# Altium schematic sheet power.SchDoc: Power supply
size A4; Organization: GPA & FRYK Industries; DocumentNumber: 6; Revision: REV 0; SheetNumber: 6; SheetTotal: 6
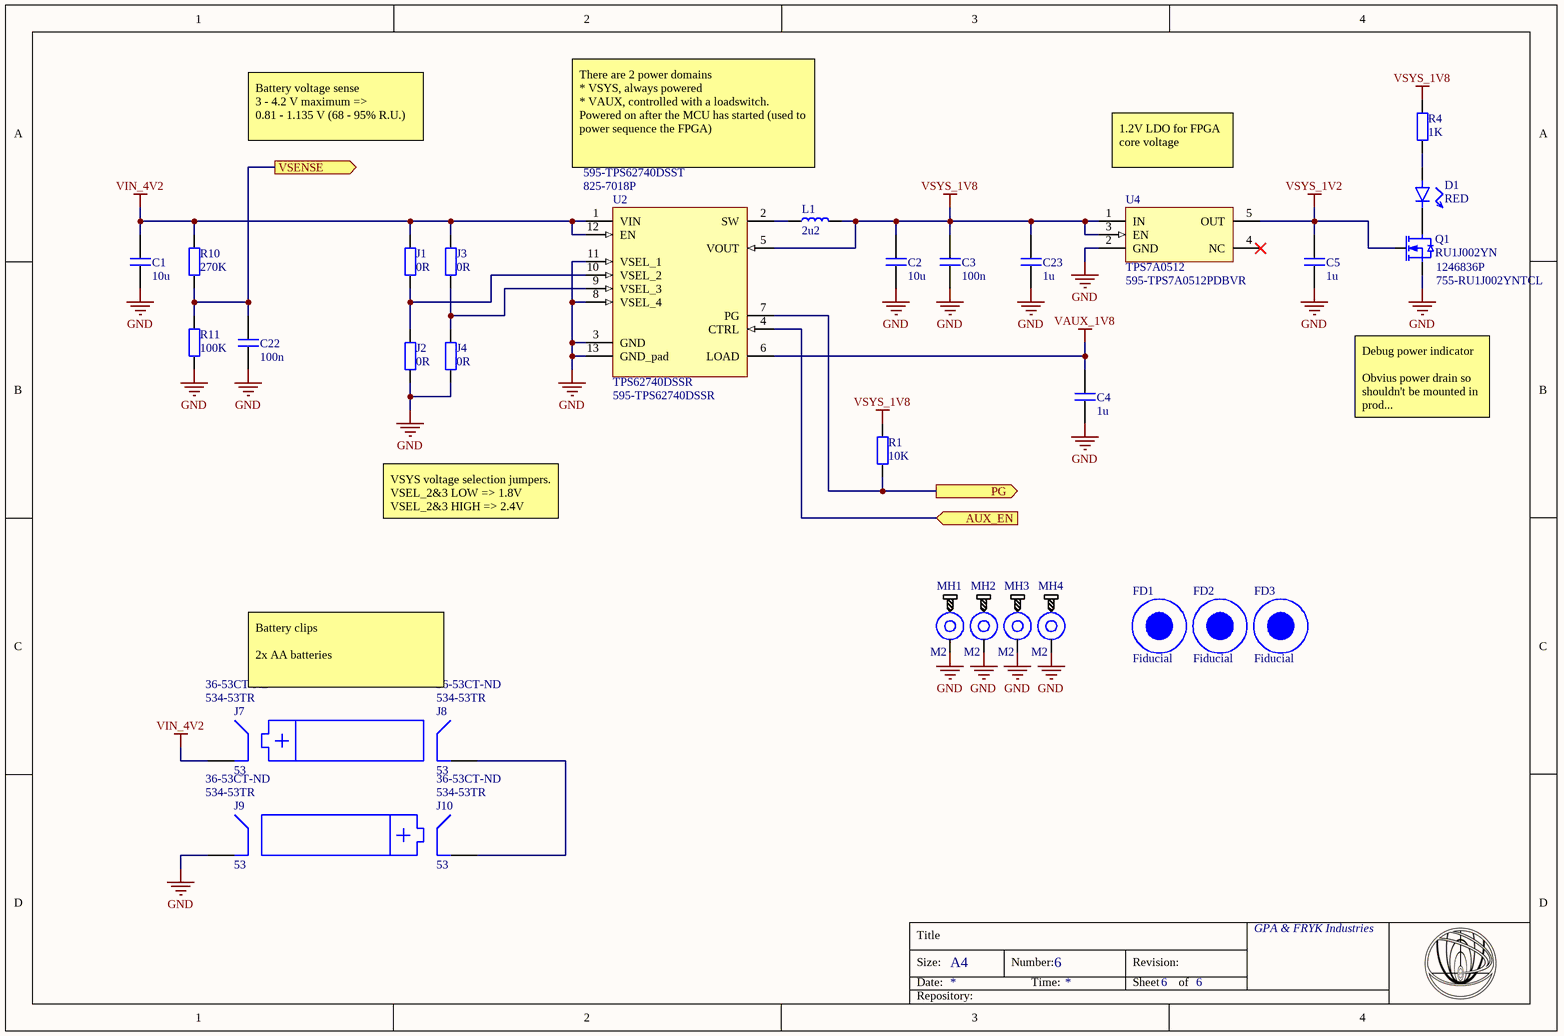
[diagram p0: power.SchDoc]

## Parts
C1  value 10u  [CAPC3216X14N]  (hidden comment: cap)
C2  value 10u  [CAPC3216X14N]  (hidden comment: cap)
C3  value 100n  [CAPC1005X06N]  (hidden comment: cap)
C4  value 1u  [CAPC2012X11N]  (hidden comment: cap)
C5  value 1u  [CAPC2012X11N]  (hidden comment: cap)
C22  value 100n  [CAPC1005X06N]  (hidden comment: cap)
C23  value 1u  [CAPC2012X11N]  (hidden comment: cap)
D1  value RED  [CAPCP1005X06N]  (hidden comment: led)
FD1  Fiducial  [fiducial_1_3]  (no BOM)
FD2  Fiducial  [fiducial_1_3]  (no BOM)
FD3  Fiducial  [fiducial_1_3]  (no BOM)
J1  value 0R  [RESC1005X04N]  (hidden comment: res)
J2  value 0R  [RESC1005X04N]  (hidden comment: res)
J3  value 0R  [RESC1005X04N]  (hidden comment: res)
J4  value 0R  [RESC1005X04N]  (hidden comment: res)
J7  53  Supplier Part Number 1: 534-53TR  Supplier Part Number 2: 36-53CT-ND  [ke53]
J8  53  Supplier Part Number 1: 534-53TR  Supplier Part Number 2: 36-53CT-ND  [ke53]
J9  53  Supplier Part Number 1: 534-53TR  Supplier Part Number 2: 36-53CT-ND  [ke53]
J10  53  Supplier Part Number 1: 534-53TR  Supplier Part Number 2: 36-53CT-ND  [ke53]
L1  value 2u2  [INDC3216X20N]  (hidden comment: ind)
MH1  M2  [mount_m2l]  (no BOM)
MH2  M2  [mount_m2l]  (no BOM)
MH3  M2  [mount_m2l]  (no BOM)
MH4  M2  [mount_m2l]  (no BOM)
Q1  RU1J002YN  Supplier Part Number 1: 1246836P  Supplier Part Number 2: 755-RU1J002YNTCL  [SOTFL65P210X105-3N]
R1  value 10K  [RESC1005X04N]  (hidden comment: res)
R4  value 1K  [RESC1005X04N]  (hidden comment: res)
R10  value 270K  [RESC1005X04N]  (hidden comment: res)
R11  value 100K  [RESC1005X04N]  (hidden comment: res)
U2  TPS62740DSSR  Supplier Part Number 1: 595-TPS62740DSSR  Supplier Part Number 2: 825-7018P  Supplier Part Number 3: 595-TPS62740DSST  [SON50P200X80_HS-13N]
U4  TPS7A0512  Supplier Part Number 1: 595-TPS7A0512PDBVR  [SOT95P280X145-5N]

## Ports
AUX_EN (in), PG (out), VSENSE (out)

## Nets
GND: C1.1 C2.1 C3.1 C4.1 C5.1 C22.1 C23.1 J2.1 J4.1 J9.1 MH1.1 MH2.1 MH3.1 MH4.1 Q1.2(S) R11.1 U2.3(GND) U2.8(VSEL_4) U2.11(VSEL_1) U2.13(GND_pad) U4.2(GND)
VAUX_1V8: C4.2 U2.6(LOAD)
VIN_4V2: C1.2 J1.2 J3.2 J7.1 R10.2 U2.1(VIN) U2.12(EN)
VSYS_1V2: C5.2 Q1.1(G) U4.5(OUT)
VSYS_1V8: C2.2 C3.2 C23.2 L1.2 R1.2 R4.2 U2.5(VOUT) U4.1(IN) U4.3(EN)
AUX_EN: U2.4(CTRL) ; port AUX_EN
PG: R1.1 U2.7(PG) ; port PG
VSENSE: C22.2 R10.1 R11.2 ; port VSENSE
NetD1_A: D1.A R4.1
NetD1_C: D1.C Q1.3(D)
NetJ1_1: J1.1 J2.2 U2.10(VSEL_2)
NetJ3_1: J3.1 J4.2 U2.9(VSEL_3)
NetJ8_1: J8.1 J10.1
NetL1_1: L1.1 U2.2(SW)

Not connected (* = marked no-connect by the designer): U4 4(NC)*

## Notes on the sheet
- Battery voltage sense
  3 - 4.2 V maximum =>
  0.81 - 1.135 V (68 - 95% R.U.)
- There are 2 power domains
  * VSYS, always powered
  * VAUX, controlled with a loadswitch. Powered on after the MCU has started (used to power sequence the FPGA)
- 1.2V LDO for FPGA core voltage
- Debug power indicator
  Obvius power drain so shouldn't be mounted in prod...
- VSYS voltage selection jumpers.
  VSEL_2&3 LOW => 1.8V
  VSEL_2&3 HIGH => 2.4V
- Battery clips
  2x AA batteries
- Title
- Size:
- Date:
- A4
- Number:
- Time:
- Revision:
- Sheet
- of
- Repository:

## Library data of the parts
C1 C2 = cap: Capacitor; type: X5R; voltage: *; #digikey: *; #mouser: *; Supplier 1: Mouser; Supplier Part Number 1: 810-C3216X5R1C106M
C3-C5 C22 C23 = cap: Capacitor; type: X7R; voltage: *; #digikey: *; #mouser: *; Supplier 1: Mouser
  C3 C22: Supplier Part Number 1: 81-GCM155R71H103KA5J
  C4 C5 C23: Supplier Part Number 1: 77-VJ0805Y105MXQTBC
D1 = led: pin to pad: A>1 C>2; Supplier 1: RSComponents; Supplier Part Number 1: 1332893P; Supplier 2: Mouser; Supplier Part Number 2: 755-SML-P12M2TT86R
J1-J4 R1 R4 R10 R11 = res: Resistor; power: *; voltage: *; #digikey: *; #mouser: *
J7-J10 = ke53: Cylindrical Battery Contacts, Clips, Holders & Springs SMT Battery clip FOR AA; ComponentLink1Description: datasheet; ComponentLink1URL: https://www.mouser.se/datasheet/2/215/3-745929.pdf; Supplier 1: Mouser; Supplier 2: Digi-Key
L1 = ind: Inductor; current: *; #digikey: *; #mouser: *; Supplier 1: Mouser; Supplier Part Number 1: 963-LB3218T2R2M; Supplier 2: RSComponents; Supplier Part Number 2: 755-4703
MH1-MH4 = mounting_hole: Mounting hole
Q1 = ru1j002yn: N-channel 50V 200mA Small signal MOSFET; ComponentLink1Description: datasheet; ComponentLink1URL: https://www.mouser.se/datasheet/2/348/ru1j002yn-e-1018335.pdf; Supplier 1: RSComponents; Supplier 2: Mouser
U2 = tps62740dssr: TPS6274x 360nA IQ Step Down Converter For Low Power Applications; ComponentLink1Description: datasheet; ComponentLink1URL: http://www.ti.com/general/docs/suppproductinfo.tsp?distId=26&gotoUrl=http%3A%2F%2Fwww.ti.com%2Flit%2Fgpn%2Ftps62740; Supplier 1: Mouser; Supplier 2: RSComponents; Supplier 3: Mouser
U4 = tps7a0512pdbvr: TPS7A05 1-µA Ultralow IQ, 200-mA, Low-Dropout Regulator; ComponentLink1Description: datasheet; ComponentLink1URL: http://www.ti.com/lit/ds/symlink/tps7a05.pdf?HQS=TI-null-null-mousermode-df-pf-null-wwe&DCM=yes&ref_url=https%3A%2F%2Fwww.mouser.se%2F; Supplier 1: Mouser